# Altium schematic sheet _1__Cover_Page.SchDoc
size A4; DocumentNumber: 1; SheetNumber: 1; SheetTotal: 2
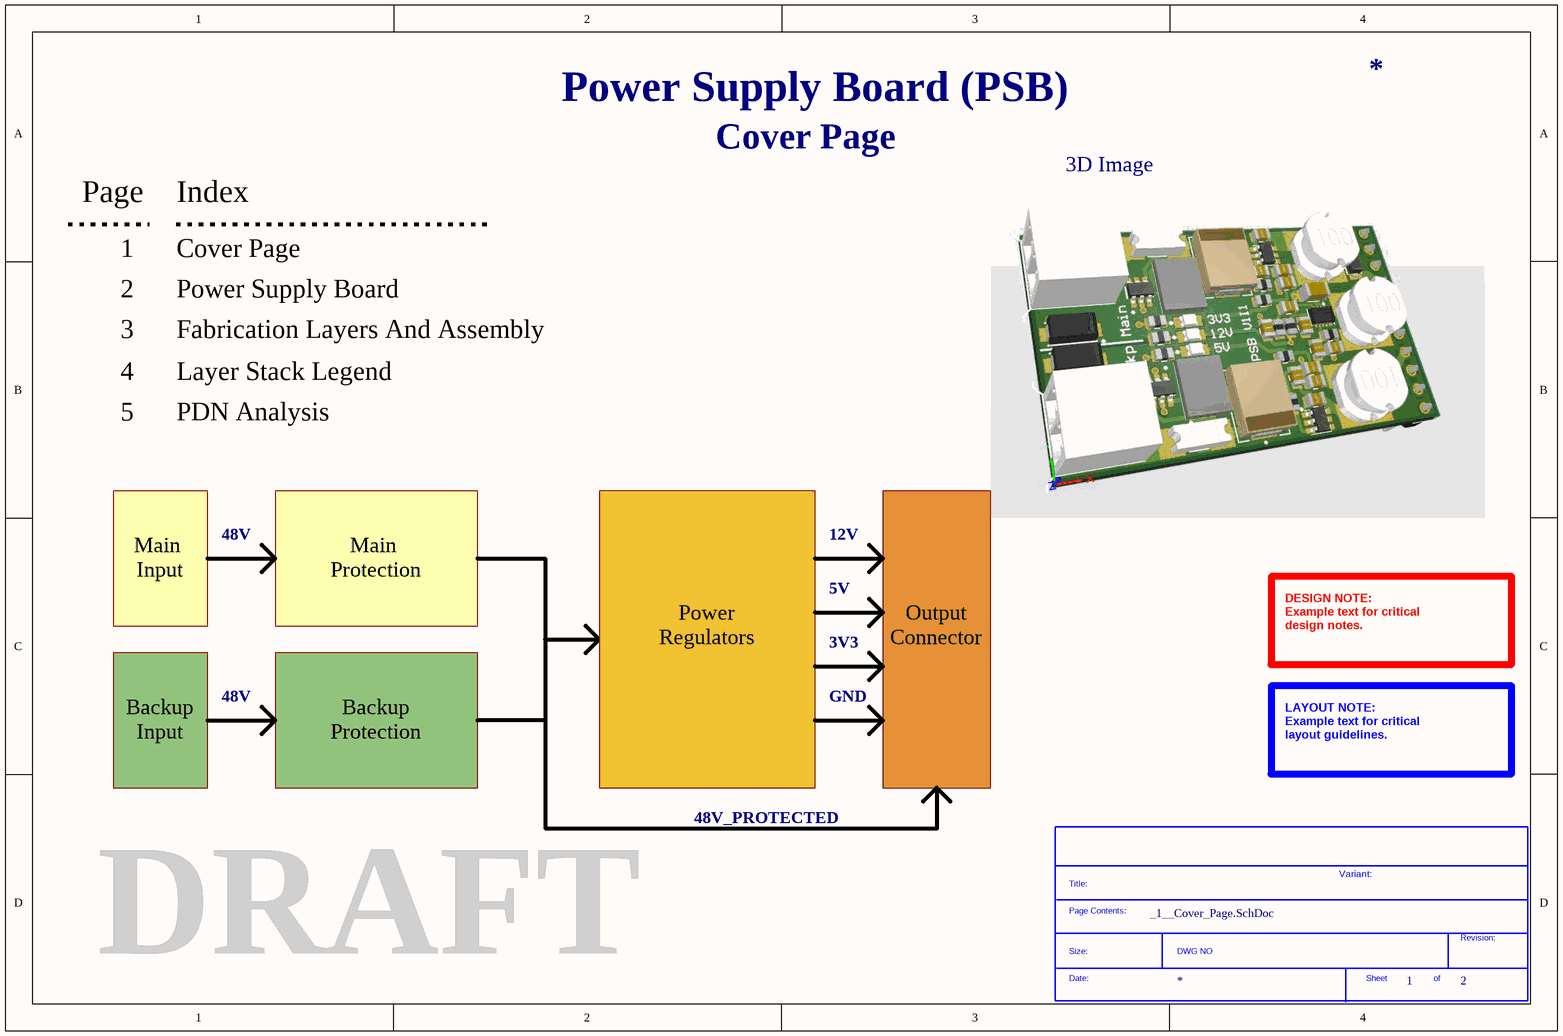
[diagram p0: _1__Cover_Page.SchDoc]

## Parts
*?  SDTitleBlock  (value not drawn)  (graphical)

## Notes on the sheet
- Power Supply Board (PSB)
- Cover Page
- 3D Image
- Page
- Index
- 1
- 2
- Power Supply Board
- 3
- 4
- Fabrication Layers And Assembly
- Layer Stack Legend
- 5
- PDN Analysis
- Main
  Input
- 48V
- Main
  Protection
- 12V
- Power Regulators
- 5V
- 3V3
- Output Connector
- DESIGN NOTE:
  Example text for critical
  design notes.
- GND
- Backup
  Input
- Backup
  Protection
- LAYOUT NOTE:
  Example text for critical
  layout guidelines.
- 48V_PROTECTED
- Variant:
- DRAFT
- Title
- Size:
- Date:
- A4
- Number:
- Time:
- Revision:
- Sheet
- of
- File:
- (in symbol SDTitleBlock) Title:; Page Contents:; Revision:; Size:; DWG NO; Date:; Sheet; of